# Altium schematic sheet mini_ups.SchDoc
size A; DrawnBy: Team Eclipse; SheetNumber: 1; SheetTotal: 1
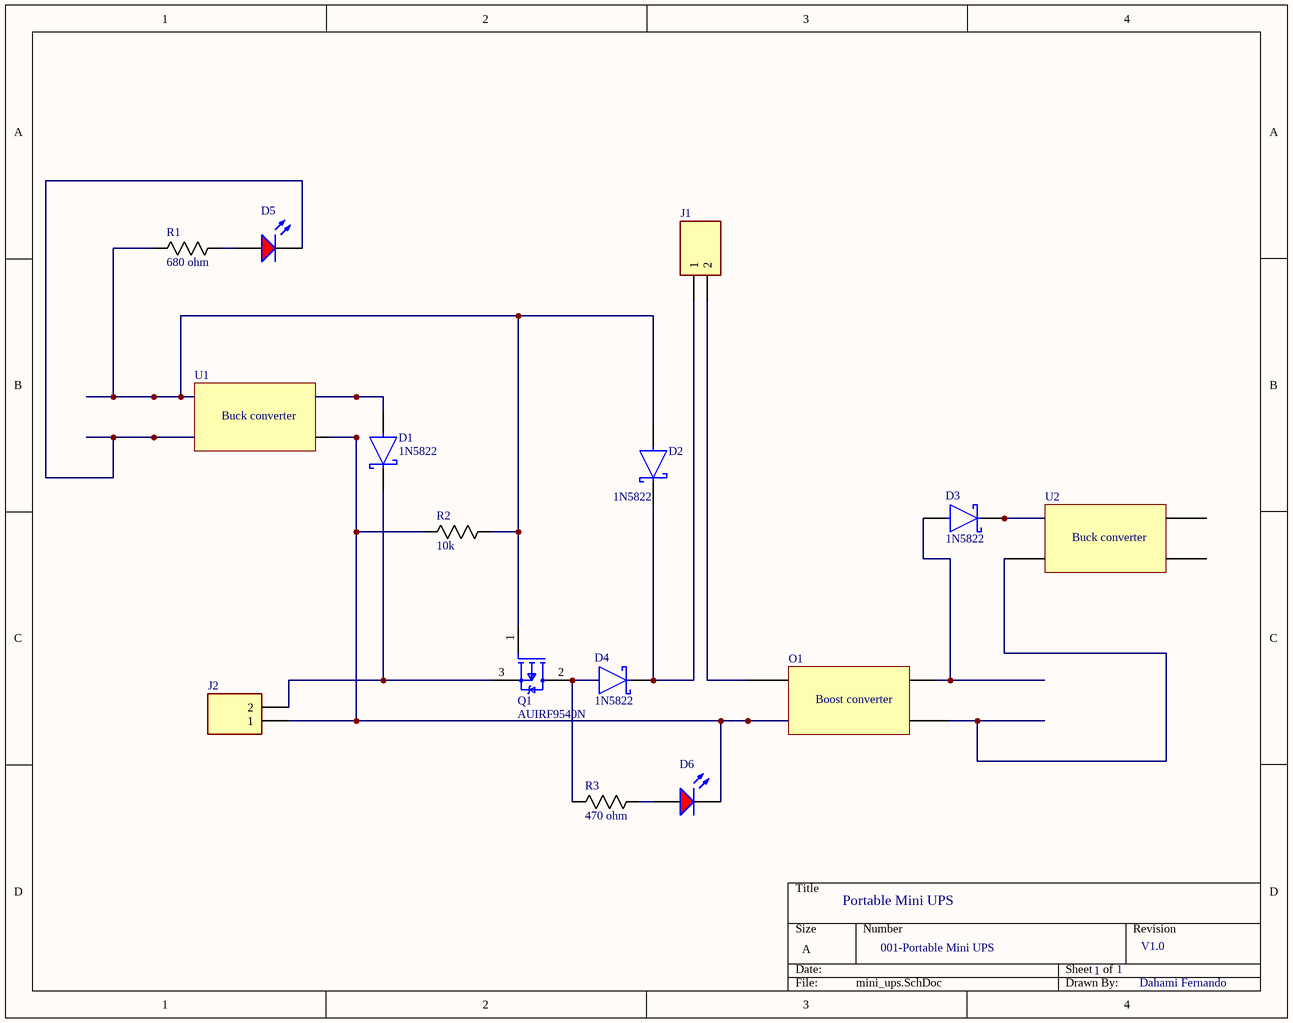
[diagram p0: mini_ups.SchDoc]

## Parts
D1  1N5822  [FP-DO-201AD-MFG]
D2  1N5822  [FP-DO-201AD-MFG]
D3  1N5822  [FP-DO-201AD-MFG]
D4  1N5822  [FP-DO-201AD-MFG]
D5  151033RS03000  [WL-TMRW_D3.9H10.5]  (value not drawn)
D6  151033RS03000  [WL-TMRW_D3.9H10.5]  (value not drawn)
J1  TB010-508-02BE  [CUI_TB010-508-02BE]  (value not drawn)
J2  TB010-508-02BE  [CUI_TB010-508-02BE]  (value not drawn)
O1  Boost converter  [Boost]
Q1  AUIRF9540N  [FP-TO-220AB-MFG]
R1  680 ohm  [STA_CF14_STP]
R2  10k  [STA_CF14_STP]
R3  470 ohm  [STA_CF14_STP]
U1  Buck converter  [Buck]
U2  Buck converter  [Buck]

## Nets
NetD1_1: D1.1(C) J2.2 Q1.3(S)
NetD1_2: D1.2(A) U1.4
NetD2_1: D2.1(C) D4.1(C) J1.1
NetD2_2: D2.2(A) Q1.1(G) R1.1 R2.2 U1.1
NetD3_1: D3.1(C) U2.1
NetD3_2: D3.2(A) O1.4
NetD4_2: D4.2(A) Q1.2(D) R3.1
NetD5_1: D5.1(K) U1.2
NetD5_2: D5.2(A) R1.2
NetD6_1: D6.1(K) J2.1 O1.2 R2.1 U1.3
NetD6_2: D6.2(A) R3.2
NetJ1_2: J1.2 O1.1
NetO1_3: O1.3 U2.2

Not connected (* = marked no-connect by the designer): U2 3 4

## Notes on the sheet
- Portable Mini UPS
- 001-Portable Mini UPS
- 1
- V1.0
- Dahami Fernando

## Library data of the parts
D1-D4 = CMP-12187-000025-1: DIODE SCHOTTKY 40V 3A DO201AD; Manufacturer: STMicroelectronics; Max Junction Temp: +150°C; Peak Reverse Current: 2mA; Max Surge Forward Current: 80A; Temperature Range High: +150°C; Automotive: No; RoHS: TRUE; ComponentLink2Description: Datasheet; Manufacturer Part Number: 1N5822; Lead Free: Yes; Octopart: https://octopart.com/1n5822-stmicroelectronics-323225; Device Class L2: Diodes; Max Repetitive Reverse Voltage: 40V; Temperature: to +150°C; Height: 5.3mm; Category: Diode; Digikey Description: DIODE SCHOTTKY 40V 3A DO201AD; ComponentLink2URL: https://www.st.com/resource/en/datasheet/1n5822.pdf; Device Class L3: Schottky Diodes; Device Class L1: Discrete Semiconductors; Forward Current: 3A; Mouser Description: Schottky Diodes & Rectifiers Vr/40V Io/3A BULK; Package: DO-201AD
D5 D6 = CMP-1489-00004-2: NexarPartId: 29717810; Luminous Intensity: 2.6cd; Forward Current: 100mA; Color: Red; Peak Wavelength: 628nm; Max Reverse Voltage (DC): 5V; Wavelength: 621nm; Lens Size: 3mm; Lens Style: Circular, Clear, Round; Forward Voltage: 2V; Viewing Angle: 30°; Test Current: 20mA; Height: 5.3mm; Width: 3mm; Case/Package: Radial; Mount: Through Hole; Length: 3mm; Packaging: Bulk; Dominant Wavelength: 621nm; REACH SVHC: Unknown; RoHS: Compliant; Min Operating Temperature: -40°C; Max Operating Temperature: 85°C
J1 J2 = TB010-508-02BE: 2~24 Poles, Screw Type, Horizontal, 5.08 Pitch, 26~12 (AWG), Terminal Block Connector; MF: CUI Devices; MP: TB010-508-02BE; Package: None; Purchase-URL: https://pricing.snapeda.com/search/part/TB010-508-02BE/?ref=eda; Price: None; Value: *; SnapEDA_Link: https://www.snapeda.com/parts/TB010-508-02BE/CUI+Devices/view-part/?ref=snap; CUI_purchase_URL: https://www.cuidevices.com/product/interconnect/connectors/terminal-blocks/tb010-508-series?utm_source=snapeda.com&utm_medium=referral&utm_campaign=snapedaBOM; Check_prices: https://www.snapeda.com/parts/TB010-508-02BE/CUI+Devices/view-part/?ref=eda; Availability: In Stock
O1 = Boost: Boost converter module
Q1 = CMP-00196-74197148-1: AUIRF9540N Automotive Q101 -100V Single P-Channel HEXFET Power MOSFET in a TO-220AB Package; Continuous Drain Current (ID): -23A; Max Junction Temperature (Tj): 175°C; Threshold Voltage: -2V; On-State Resistance: 117mΩ; Number of Elements: 1; Turn-Off Delay Time: 51ns; Turn-On Delay Time: 15ns; Rise Time: 67ns; Gate to Source Voltage (Vgs): 20V; Max Power Dissipation: 140W; Input Capacitance: 1.3nF; Width: 4.82mm; Drain to Source Breakdown Voltage: -100V; NexarPartId: 74197148; Package Quantity: 1000; Fall Time: 51ns; REACH SVHC: No SVHC; Number of Pins: 3; Max Operating Temperature: 175°C; Min Operating Temperature: -55°C; Length: 10.66mm; Lifecycle Status: Obsolete; RoHS: Compliant; Drain to Source Resistance: 117mΩ; Drain to Source Voltage (Vdss): -100V; Power Dissipation: 140W; Case/Package: TO-220AB; Height: 16.51mm; Radiation Hardening: No; Mount: Through Hole
R1 R3 = CF14JT10K0: No Description Available; Mfr_Name: Stackpole International
R2 = CF14JT10K0: RES 10K OHM 5% 1/4W AXIAL; Mfr_Name: Stackpole International; Supplier 1: Digikey; Supplier Part Number 1: CF14JT10K0CT-ND
U1 U2 = Buck: Buck converter module